# EAGLE design MotherboardV2.1 (EAGLE 7.2.0)

## Sheet 1 of 8: LATHCING CIRCUIT
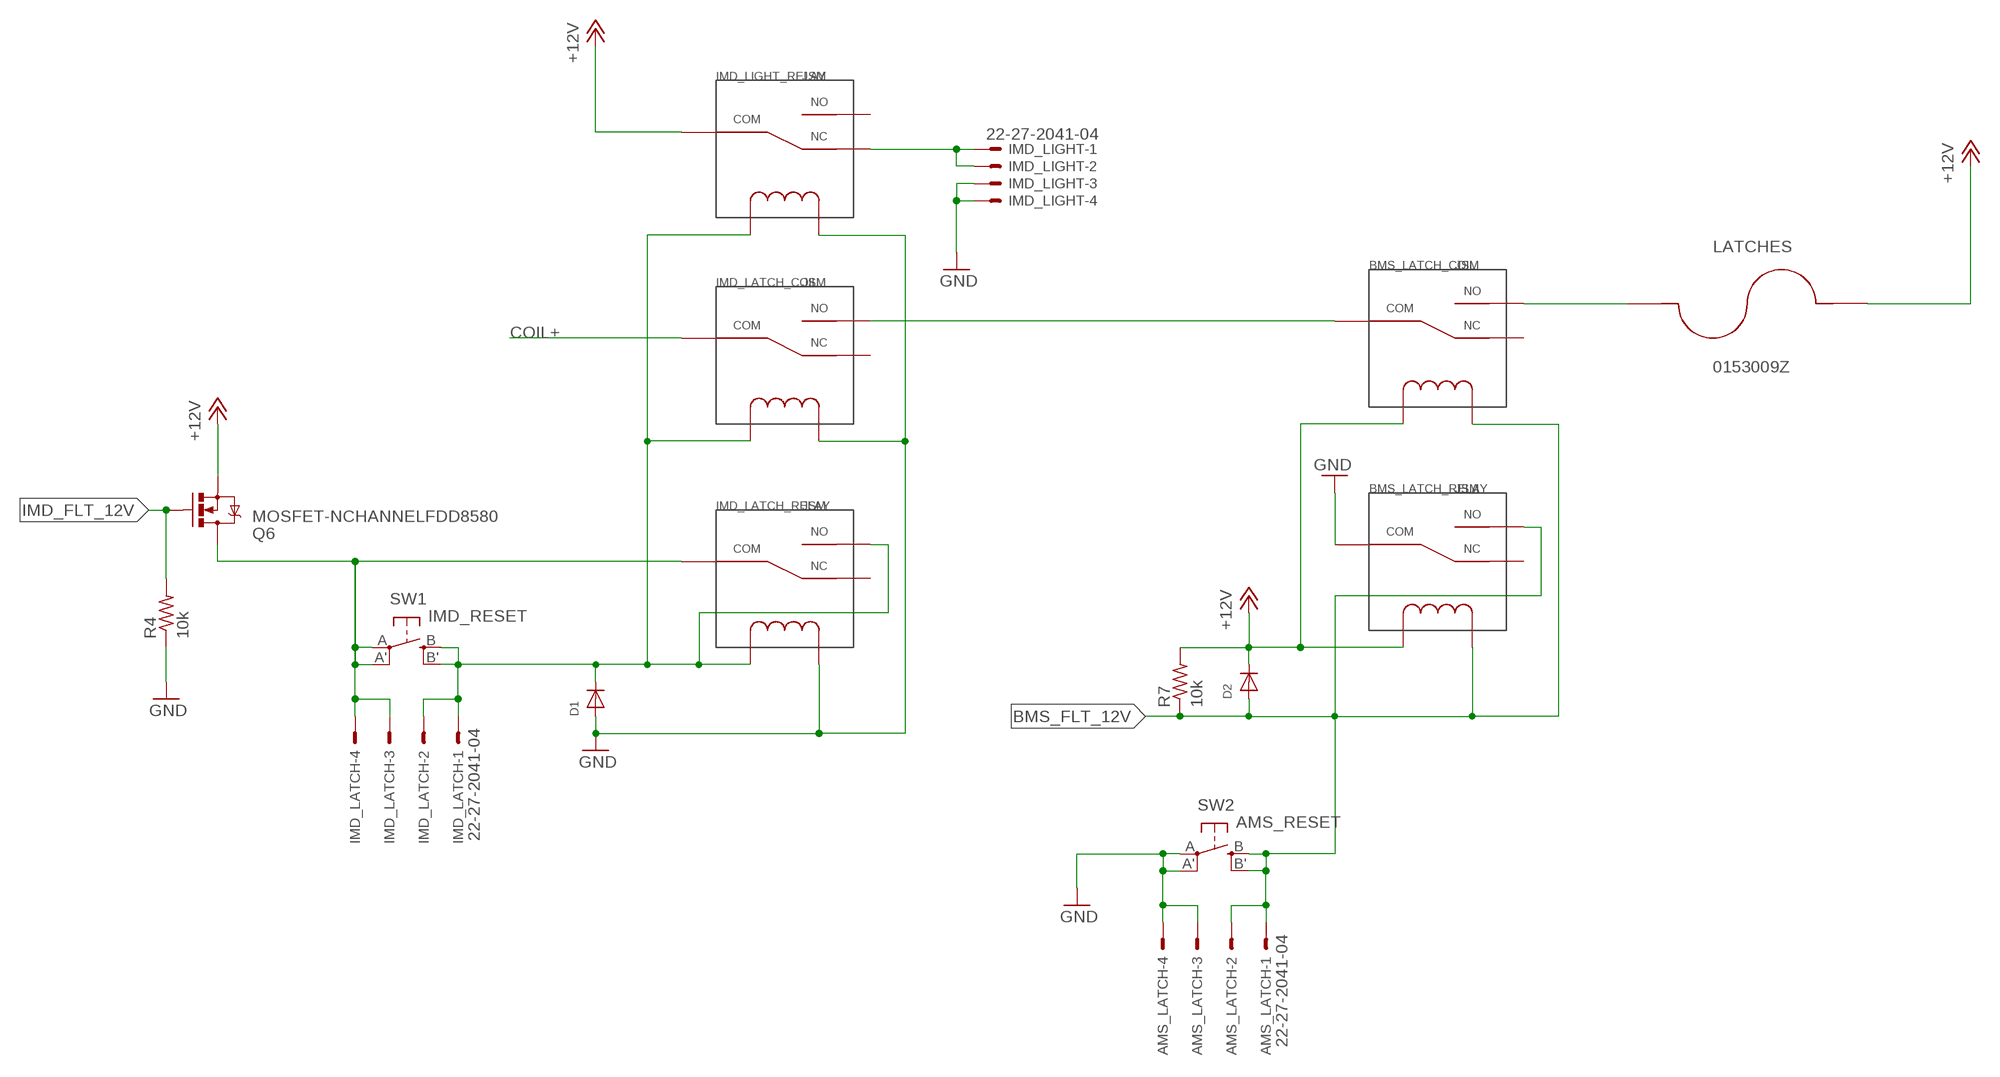
[diagram p0: schematic, sheet 1]

### Parts
AMS_LATCH  22-27-2041-04  [6410-04]
BMS_LATCH_COIL  JSM  [JS-M]
BMS_LATCH_RELAY  JSM  [JS-M]
D1  DIODESOD-123  [SOD-123]
D2  DIODESOD-123  [SOD-123]
IMD_LATCH  22-27-2041-04  [6410-04]
IMD_LATCH_COIL  JSM  [JS-M]
IMD_LATCH_RELAY  JSM  [JS-M]
IMD_LIGHT  22-27-2041-04  [6410-04]
IMD_LIGHT_RELAY  JSM  [JS-M]
LATCHES  0153009Z  [MINIFUSEHOLDER]
Q6  MOSFET-NCHANNELFDD8580  [DPAK]
R4  10k  R-US_M0805  [M0805]
R7  10k  R-US_M0805  [M0805]
SW1  IMD_RESET  SPST_TACT-EVQQ2  [EVQ-Q2]
SW2  AMS_RESET  SPST_TACT-EVQQ2  [EVQ-Q2]

### Nets
+12V: BMS_LATCH_COIL.COIL1 BMS_LATCH_RELAY.COIL1 D2.C IMD_LIGHT_RELAY.COM LATCHES.P$2 Q6.3(S) R7.2 ; also sheet 2,3,4,5,6
BMS_FLT_12V: AMS_LATCH.1 AMS_LATCH.2 BMS_LATCH_COIL.COIL2 BMS_LATCH_RELAY.COIL2 BMS_LATCH_RELAY.NO D2.A R7.1 SW2.B'(S1) SW2.B(S) ; also sheet 2,4,7
COIL+: IMD_LATCH_COIL.COM ; also sheet 2
GND: AMS_LATCH.3 AMS_LATCH.4 BMS_LATCH_RELAY.COM D1.A IMD_LATCH_COIL.COIL2 IMD_LATCH_RELAY.COIL2 IMD_LIGHT.3 IMD_LIGHT.4 IMD_LIGHT_RELAY.COIL2 R4.1 SW2.A'(P1) SW2.A(P) ; also sheet 2,3,4,5,6,7
IMD_FLT_12V: Q6.1(G) R4.2 ; also sheet 2,7
IMD_LATCH_SW1: IMD_LATCH.3 IMD_LATCH.4 IMD_LATCH_RELAY.COM Q6.4(D) SW1.A'(P1) SW1.A(P) ; also sheet 2
IMD_LATCH_SW2: D1.C IMD_LATCH.1 IMD_LATCH.2 IMD_LATCH_COIL.COIL1 IMD_LATCH_RELAY.COIL1 IMD_LATCH_RELAY.NO IMD_LIGHT_RELAY.COIL1 SW1.B'(S1) SW1.B(S) ; also sheet 2
N$11: BMS_LATCH_COIL.COM IMD_LATCH_COIL.NO
N$13: IMD_LIGHT.1 IMD_LIGHT.2 IMD_LIGHT_RELAY.NC
N$35: BMS_LATCH_COIL.NO LATCHES.P$1
Unconnected: BMS_LATCH_COIL.NC BMS_LATCH_RELAY.NC IMD_LATCH_COIL.NC IMD_LATCH_RELAY.NC IMD_LIGHT_RELAY.NO

## Sheet 2 of 8: CONNECTORS
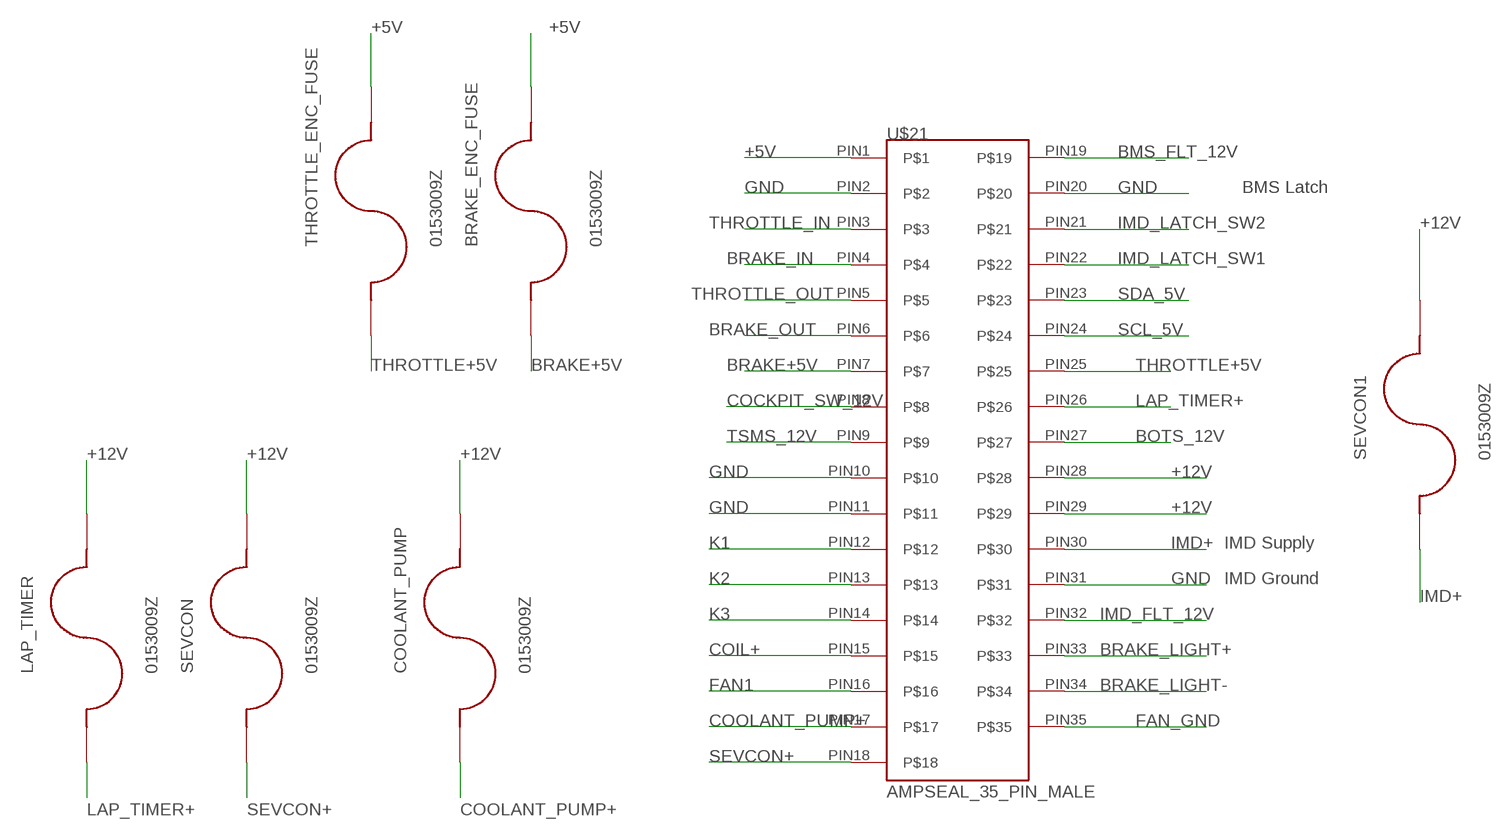
[diagram p1: schematic, sheet 2]

### Parts
BRAKE_ENC_FUSE  0153009Z  [MINIFUSEHOLDER]
COOLANT_PUMP  0153009Z  [MINIFUSEHOLDER]
LAP_TIMER  0153009Z  [MINIFUSEHOLDER]
SEVCON  0153009Z  [MINIFUSEHOLDER]
SEVCON1  0153009Z  [MINIFUSEHOLDER]
THROTTLE_ENC_FUSE  0153009Z  [MINIFUSEHOLDER]
U$21  AMPSEAL_35_PIN_MALE  [AMPSEAL_35_PIN_MALE]

### Nets
+5V: BRAKE_ENC_FUSE.P$2 THROTTLE_ENC_FUSE.P$2 U$21.PIN1 ; also sheet 5,6,7
+12V: COOLANT_PUMP.P$2 LAP_TIMER.P$2 SEVCON1.P$2 SEVCON.P$2 U$21.PIN28 U$21.PIN29 ; also sheet 1,3,4,5,6
BMS_FLT_12V: U$21.PIN19 ; also sheet 1,4,7
BOTS_12V: U$21.PIN27 ; also sheet 7
BRAKE+5V: BRAKE_ENC_FUSE.P$1 U$21.PIN7
BRAKE_IN: U$21.PIN4
BRAKE_LIGHT+: U$21.PIN33 ; also sheet 3
BRAKE_LIGHT-: U$21.PIN34 ; also sheet 3
BRAKE_OUT: U$21.PIN6
COCKPIT_SW_12V: U$21.PIN8 ; also sheet 7
COIL+: U$21.PIN15 ; also sheet 1
COOLANT_PUMP+: COOLANT_PUMP.P$1 U$21.PIN17
FAN1: U$21.PIN16 ; also sheet 4
FAN_GND: U$21.PIN35 ; also sheet 4
GND: U$21.PIN2 U$21.PIN10 U$21.PIN11 U$21.PIN20 U$21.PIN31 ; also sheet 1,3,4,5,6,7
IMD+: SEVCON1.P$1 U$21.PIN30
IMD_FLT_12V: U$21.PIN32 ; also sheet 1,7
IMD_LATCH_SW1: U$21.PIN22 ; also sheet 1
IMD_LATCH_SW2: U$21.PIN21 ; also sheet 1
K1: U$21.PIN12 ; also sheet 4
K2: U$21.PIN13 ; also sheet 4
K3: U$21.PIN14 ; also sheet 4
LAP_TIMER+: LAP_TIMER.P$1 U$21.PIN26
SCL_5V: U$21.PIN24 ; also sheet 5
SDA_5V: U$21.PIN23 ; also sheet 5
SEVCON+: SEVCON.P$1 U$21.PIN18
THROTTLE+5V: THROTTLE_ENC_FUSE.P$1 U$21.PIN25
THROTTLE_IN: U$21.PIN3
THROTTLE_OUT: U$21.PIN5
TSMS_12V: U$21.PIN9 ; also sheet 7

### Notes on the sheet
- BMS Latch
- IMD Supply
- IMD Ground

## Sheet 3 of 8: OUTPUT RELAYS
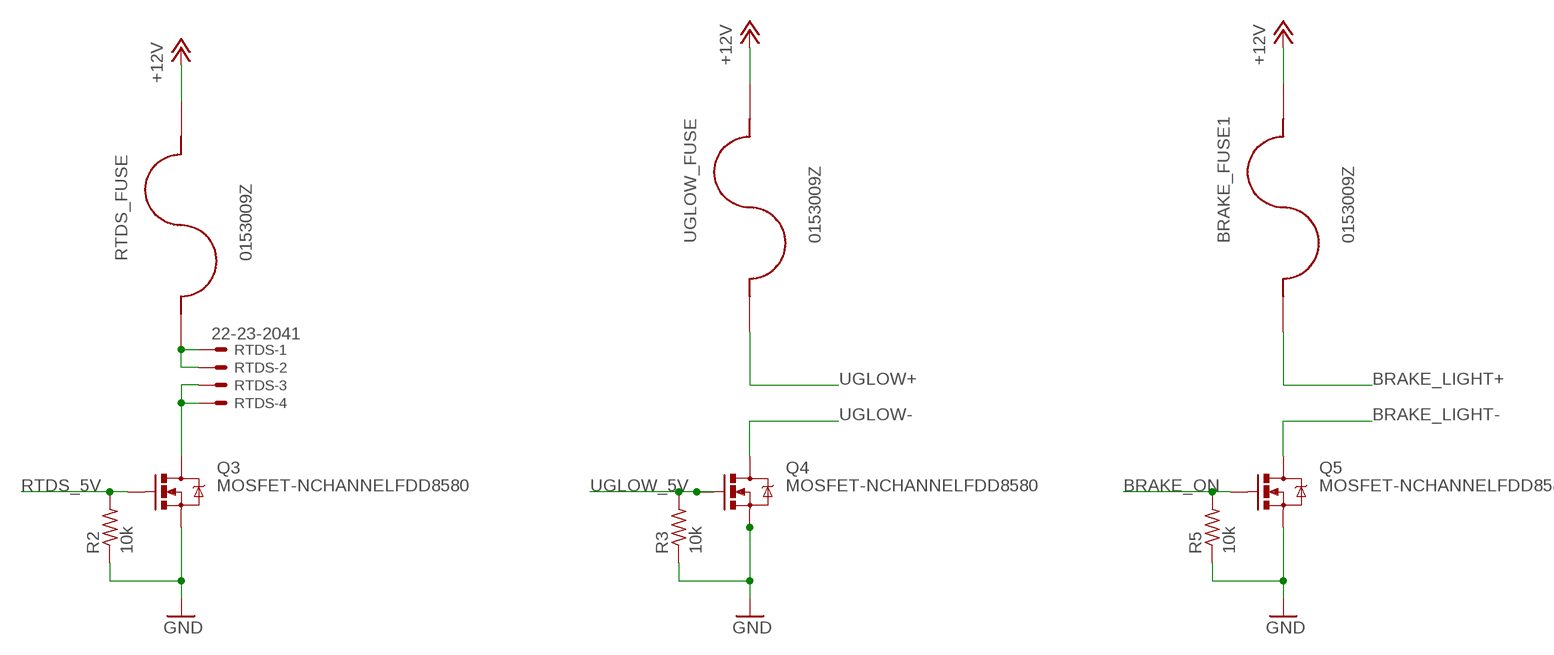
[diagram p2: schematic, sheet 3]

### Parts
BRAKE_FUSE1  0153009Z  [MINIFUSEHOLDER]
Q3  MOSFET-NCHANNELFDD8580  [DPAK]
Q4  MOSFET-NCHANNELFDD8580  [DPAK]
Q5  MOSFET-NCHANNELFDD8580  [DPAK]
R2  10k  R-US_M0805  [M0805]
R3  10k  R-US_M0805  [M0805]
R5  10k  R-US_M0805  [M0805]
RTDS  22-23-2041  [22-23-2041]
RTDS_FUSE  0153009Z  [MINIFUSEHOLDER]
UGLOW_FUSE  0153009Z  [MINIFUSEHOLDER]

### Nets
+12V: BRAKE_FUSE1.P$2 RTDS_FUSE.P$2 UGLOW_FUSE.P$2 ; also sheet 1,2,4,5,6
BRAKE_LIGHT+: BRAKE_FUSE1.P$1 ; also sheet 2
BRAKE_LIGHT-: Q5.4(D) ; also sheet 2
BRAKE_ON: Q5.1(G) R5.2
GND: Q3.3(S) Q4.3(S) Q5.3(S) R2.1 R3.1 R5.1 ; also sheet 1,2,4,5,6,7
N$1: Q3.4(D) RTDS.3 RTDS.4
N$2: RTDS.1 RTDS.2 RTDS_FUSE.P$1
RTDS_5V: Q3.1(G) R2.2 ; also sheet 5
UGLOW+: UGLOW_FUSE.P$1
UGLOW-: Q4.4(D)
UGLOW_5V: Q4.1(G) R3.2 ; also sheet 5

## Sheet 4 of 8: BMS CONNECTORS
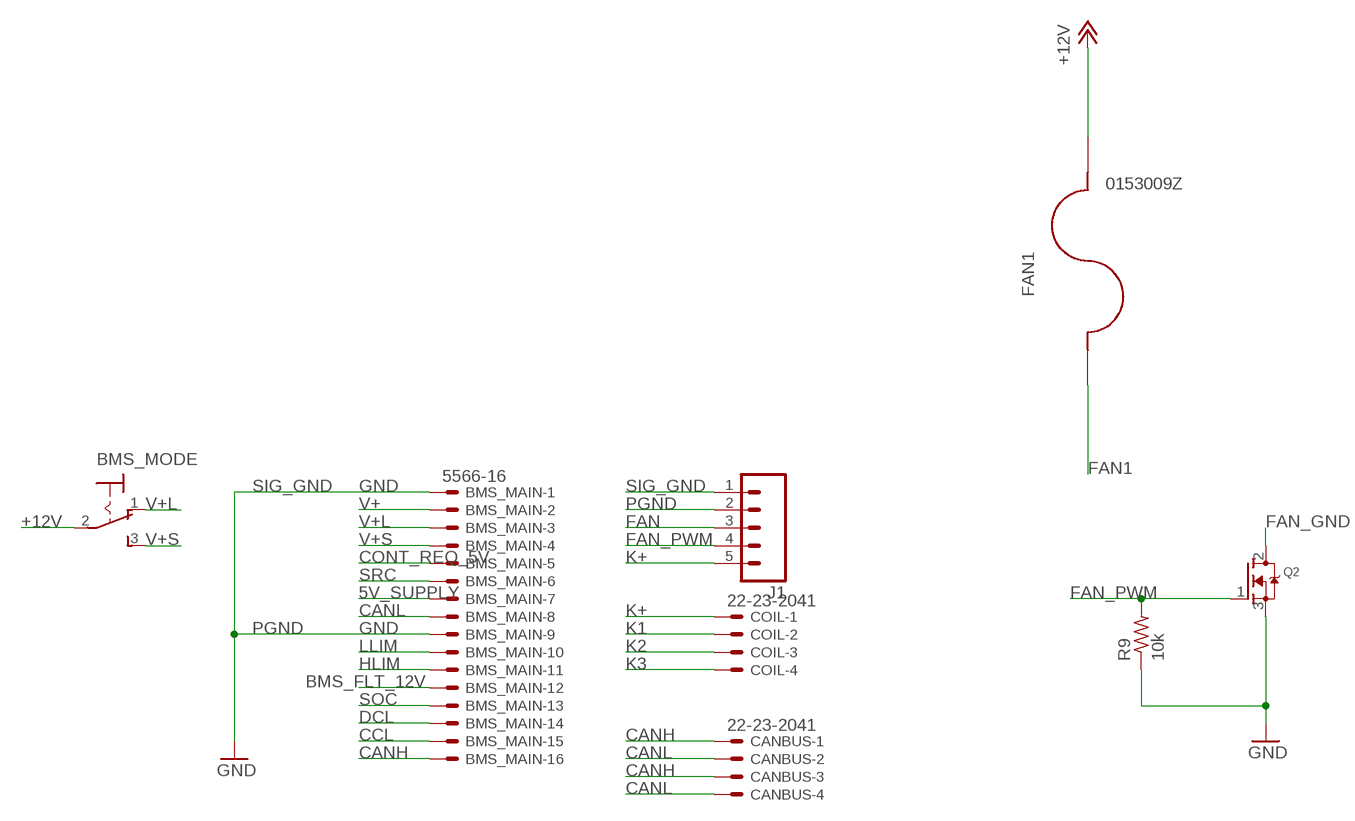
[diagram p3: schematic, sheet 4]

### Parts
BMS_MAIN  5566-16  [5566-16]
BMS_MODE  320-916  [320-916]
CANBUS  22-23-2041  [22-23-2041]
COIL  22-23-2041  [22-23-2041]
FAN1  0153009Z  [MINIFUSEHOLDER]
J1  M05LOCK  [1X05_LOCK]
Q2  MOSFET-NGDS_TO220V  [TO220V]
R9  10k  R-US_0207/9  [0207/9]

### Nets
5V_SUPPLY: BMS_MAIN.7
+12V: BMS_MODE.2(P) FAN1.P$2 ; also sheet 1,2,3,5,6
BMS_FLT_12V: BMS_MAIN.12 ; also sheet 1,2,7
CANH: BMS_MAIN.16 CANBUS.1 CANBUS.3
CANL: BMS_MAIN.8 CANBUS.2 CANBUS.4
CCL: BMS_MAIN.15
CONT_REQ_5V: BMS_MAIN.5 ; also sheet 5
DCL: BMS_MAIN.14
FAN: J1.3
FAN1: FAN1.P$1 ; also sheet 2
FAN_GND: Q2.2(D) ; also sheet 2
FAN_PWM: J1.4 Q2.1(G) R9.2
GND: BMS_MAIN.1 BMS_MAIN.9 Q2.3(S) R9.1 ; also sheet 1,2,3,5,6,7
HLIM: BMS_MAIN.11
K1: COIL.2 ; also sheet 2
K2: COIL.3 ; also sheet 2
K3: COIL.4 ; also sheet 2
K+: COIL.1 J1.5
LLIM: BMS_MAIN.10
PGND: J1.2
SIG_GND: J1.1
SOC: BMS_MAIN.13 ; also sheet 5
SRC: BMS_MAIN.6
V+: BMS_MAIN.2
V+L: BMS_MAIN.3 BMS_MODE.1(O)
V+S: BMS_MAIN.4 BMS_MODE.3(S)

### Notes on the sheet
- SIG_GND
- PGND

## Sheet 5 of 8: VCU
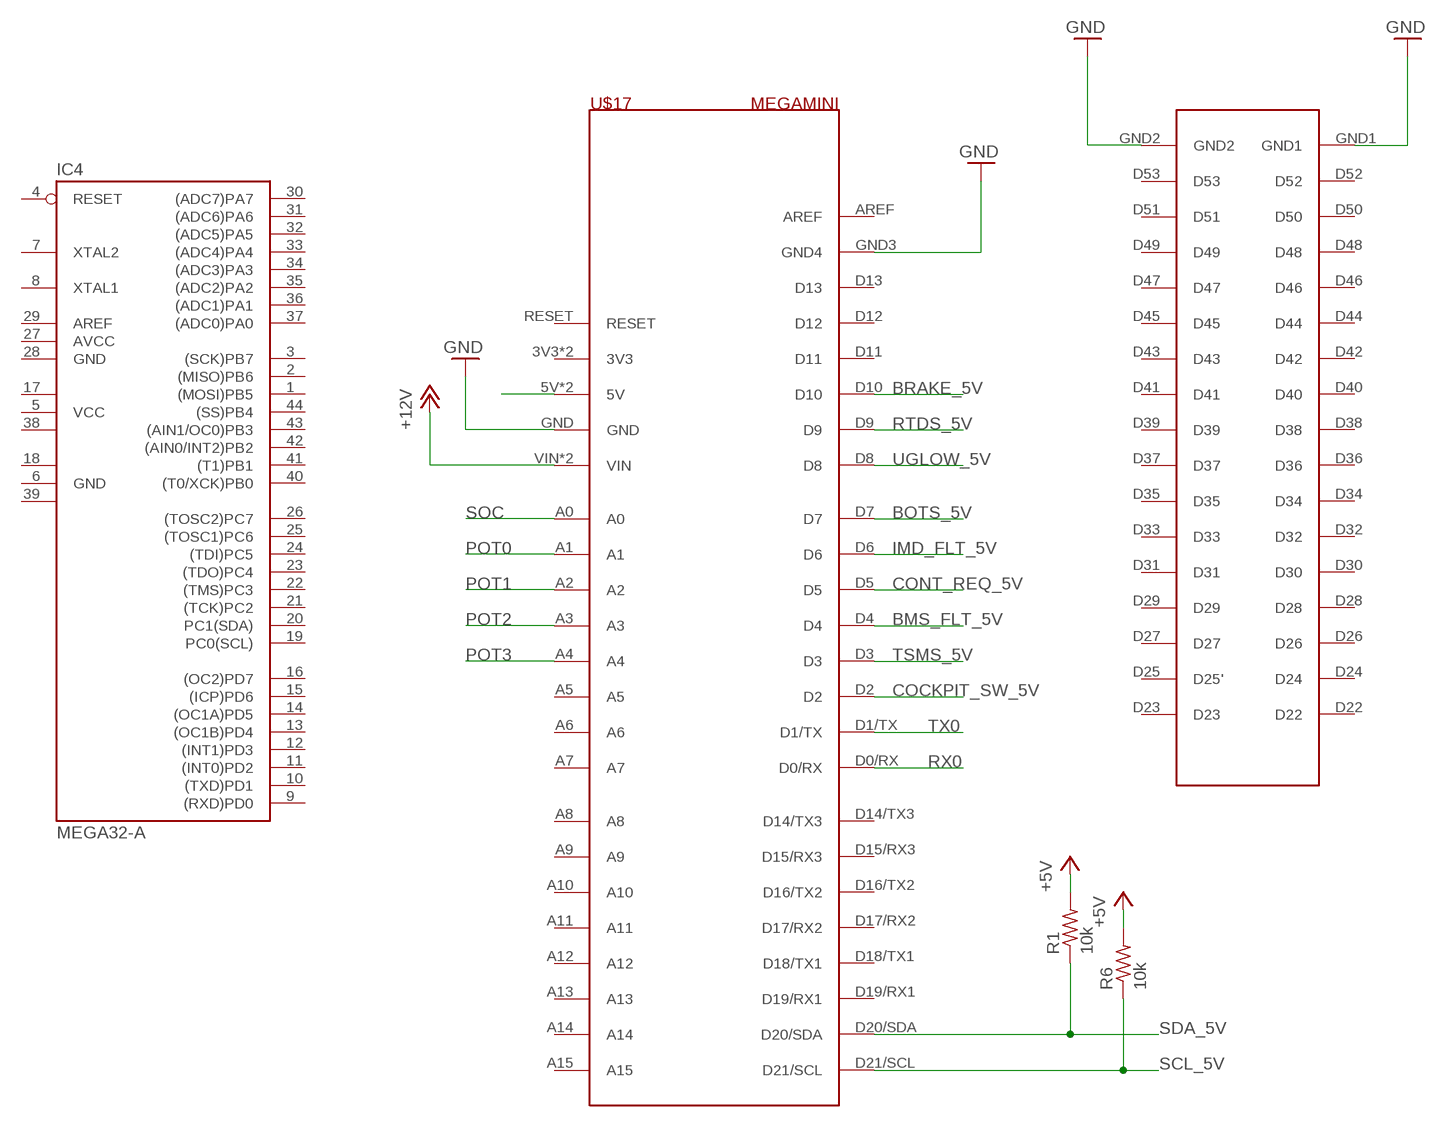
[diagram p4: schematic, sheet 5]

### Parts
IC4  MEGA32-A  [TQFP44]
R1  10k  R-US_M0805  [M0805]
R6  10k  R-US_M0805  [M0805]
U$17  MEGAMINI  [MEGAMINI]

### Nets
+5V: R1.2 R6.2 U$17.5V U$17.5V_2(5V) ; also sheet 2,6,7
+12V: U$17.VIN U$17.VIN_2(VIN) ; also sheet 1,2,3,4,6
BMS_FLT_5V: U$17.D4 ; also sheet 7
BOTS_5V: U$17.D7 ; also sheet 7
BRAKE_5V: U$17.D10
COCKPIT_SW_5V: U$17.D2 ; also sheet 7
CONT_REQ_5V: U$17.D5 ; also sheet 4
GND: U$17.GND U$17.GND1 U$17.GND2 U$17.GND3(GND4) ; also sheet 1,2,3,4,6,7
IMD_FLT_5V: U$17.D6 ; also sheet 7
POT0: U$17.A1
POT1: U$17.A2
POT2: U$17.A3
POT3: U$17.A4
RTDS_5V: U$17.D9 ; also sheet 3
RX0: U$17.D0/RX
SCL_5V: R6.1 U$17.D21/SCL ; also sheet 2
SDA_5V: R1.1 U$17.D20/SDA ; also sheet 2
SOC: U$17.A0 ; also sheet 4
TSMS_5V: U$17.D3 ; also sheet 7
TX0: U$17.D1/TX
UGLOW_5V: U$17.D8 ; also sheet 3
Unconnected: IC4.1((MOSI)PB5) IC4.2((MISO)PB6) IC4.3((SCK)PB7) IC4.4(RESET) IC4.7(XTAL2) IC4.8(XTAL1) IC4.9((RXD)PD0) IC4.10((TXD)PD1) IC4.11((INT0)PD2) IC4.12((INT1)PD3) IC4.13((OC1B)PD4) IC4.14((OC1A)PD5) IC4.15((ICP)PD6) IC4.16((OC2)PD7) IC4.19(PC0(SCL)) IC4.20(PC1(SDA)) IC4.21((TCK)PC2) IC4.22((TMS)PC3) IC4.23((TDO)PC4) IC4.24((TDI)PC5) IC4.25((TOSC1)PC6) IC4.26((TOSC2)PC7) IC4.29(AREF) IC4.30((ADC7)PA7) IC4.31((ADC6)PA6) IC4.32((ADC5)PA5) IC4.33((ADC4)PA4) IC4.34((ADC3)PA3) IC4.35((ADC2)PA2) IC4.36((ADC1)PA1) IC4.37((ADC0)PA0) IC4.40((T0/XCK)PB0) IC4.41((T1)PB1) IC4.42((AIN0/INT2)PB2) IC4.43((AIN1/OC0)PB3) IC4.44((SS)PB4) U$17.3V3 U$17.3V3_2(3V3) U$17.A5 U$17.A6 U$17.A7 U$17.A8 U$17.A9 U$17.A10 U$17.A11 U$17.A12 U$17.A13 U$17.A14 U$17.A15 U$17.AREF U$17.D11 U$17.D12 U$17.D13 U$17.D14/TX3 U$17.D15/RX3 U$17.D16/TX2 U$17.D17/RX2 U$17.D18/TX1 U$17.D19/RX1 U$17.D22 U$17.D23 U$17.D24 U$17.D25(D25') U$17.D26 U$17.D27 U$17.D28 U$17.D29 U$17.D30 U$17.D31 U$17.D32 U$17.D33 U$17.D34 U$17.D35 U$17.D36 U$17.D37 U$17.D38 U$17.D39 U$17.D40 U$17.D41 U$17.D42 U$17.D43 U$17.D44 U$17.D45 U$17.D46 U$17.D47 U$17.D48 U$17.D49 U$17.D50 U$17.D51 U$17.D52 U$17.D53 U$17.RESET

## Sheet 6 of 8: REGULATORS
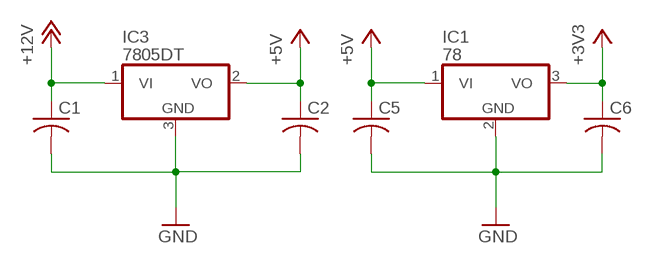
[diagram p5: schematic, sheet 6]

### Parts
C1  C-USC0805K  [C0805K]
C2  C-USC0805K  [C0805K]
C5  C-USC0805K  [C0805K]
C6  C-USC0805K  [C0805K]
IC1  78  [D2PAK]
IC3  7805DT  [TO252]

### Nets
+3V3: C6.1 IC1.3(VO)
+5V: C2.1 C5.1 IC1.1(VI) IC3.2(VO) ; also sheet 2,5,7
+12V: C1.1 IC3.1(VI) ; also sheet 1,2,3,4,5
GND: C1.2 C2.2 C5.2 C6.2 IC1.2(GND) IC3.3(GND) ; also sheet 1,2,3,4,5,7

## Sheet 7 of 8: LEVEL SHIFTING
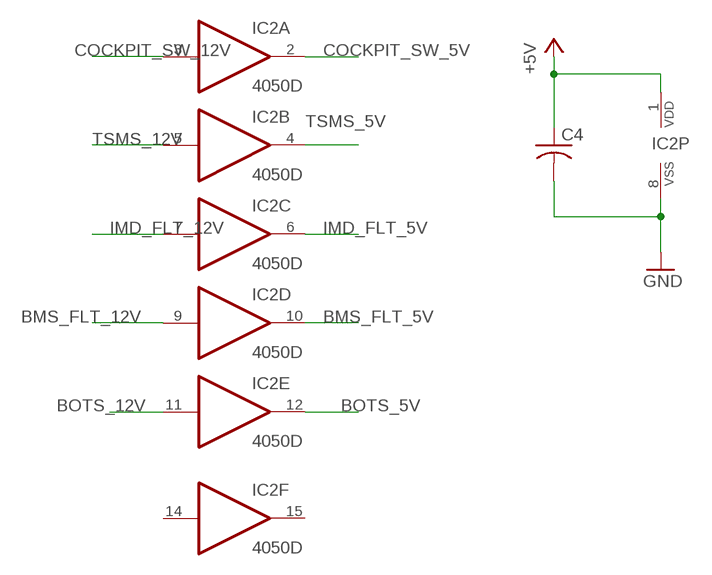
[diagram p6: schematic, sheet 7]

### Parts
C4  C-US050-024X044  [C050-024X044]
IC2  4050D  [SO16]

### Nets
+5V: C4.1 IC2.1(P:VDD) ; also sheet 2,5,6
BMS_FLT_5V: IC2.10(D:O) ; also sheet 5
BMS_FLT_12V: IC2.9(D:I) ; also sheet 1,2,4
BOTS_5V: IC2.12(E:O) ; also sheet 5
BOTS_12V: IC2.11(E:I) ; also sheet 2
COCKPIT_SW_5V: IC2.2(A:O) ; also sheet 5
COCKPIT_SW_12V: IC2.3(A:I) ; also sheet 2
GND: C4.2 IC2.8(P:VSS) ; also sheet 1,2,3,4,5,6
IMD_FLT_5V: IC2.6(C:O) ; also sheet 5
IMD_FLT_12V: IC2.7(C:I) ; also sheet 1,2
TSMS_5V: IC2.4(B:O) ; also sheet 5
TSMS_12V: IC2.5(B:I) ; also sheet 2
Unconnected: IC2.14(F:I) IC2.15(F:O)

## Sheet 8 of 8

## Power pins joined to a net without a drawn wire
AVCC: IC4.27(AVCC)
GND: IC4.6(GND) IC4.28(GND)
GND1: IC4.18(GND1)
GND2: IC4.39(GND2)
VCC: IC4.5(VCC)
VCC1: IC4.17(VCC1)
VCC2: IC4.38(VCC2)

## Library data of the parts
AMS_LATCH IMD_LATCH IMD_LIGHT = con-molex:22-?-04: CONNECTOR wire to board 2.54 mm (.1 inch) pitch header; OC_FARNELL: unknown; OC_NEWARK: unknown
BMS_LATCH_COIL BMS_LATCH_RELAY IMD_LATCH_COIL IMD_LATCH_RELAY IMD_LIGHT_RELAY = panasonic:JSM
BMS_MAIN = con-molex:5566-16: Mini FIT connector 16 pol Source: http://www.molex.com; OC_FARNELL: unknown; OC_NEWARK: unknown
BMS_MODE = switch:320-916: TOGGLE SWITCH distributor RS Components
BRAKE_ENC_FUSE BRAKE_FUSE1 COOLANT_PUMP FAN1 LAP_TIMER LATCHES RTDS_FUSE SEVCON SEVCON1 THROTTLE_ENC_FUSE UGLOW_FUSE = littelfuse:0153009Z: http://www.digikey.com/product-search/en/circuit-protection/fuseholders/655422?k=01530009 MINI ATC, MINI ATO Blade fuse holder
C1 C2 C4-C6 = adafruit:C-US: CAPACITOR, American symbol
CANBUS COIL RTDS = con-molex:22-23-2041: .100" (2.54mm) Center Header - 4 Pin; MF: MOLEX; MPN: 22-23-2041; OC_FARNELL: 1462920; OC_NEWARK: 38C0355
D1 D2 = adafruit:DIODE: Diode SMADIODE - SMA Surface Mount Package 20V 1A Schottky Diode Digikey: 641-1014-6-ND DO-1N4148 - Through Hole Small Current Diode SOD-123 20V 1 A (.5mV Vf) Schottky Diode - Digikey: MBRX120TPMSCT-ND SOD-323 10V 570mA (.38mV Vf, 3ns) Schottky Diode - Digikey: ZLLS410CT-ND SOD-523 30V 30mA Schottky Diode (RB751S-40TE61) - Digikey: RB751S-40TE61CT-ND SOT23-R/W - SOT23 Package (R = Solder Paste/Reflow Ovens, W = Hand-Soldering) BAT54Film 40V 300mA - Digikey: 497-7162-1-ND
IC1 IC3 = linear:78*: Positive VOLTAGE REGULATOR Source: http://cache.national.com/ds/LM/LM78L05.pdf http://www.fairchildsemi.com/ds/LM/LM7805.pdf
IC2 = 40xx:4050: Hex non-inverting BUFFER
IC4 = atmel:MEGA32: MICROCONTROLLER 32 Kbytes FLASH 2 Kbytes SRAM 1 Kbytes EEPROM USART 8-channel 10 bit ADC Source: www.atmel.com .. doc2503.pdf; MPN: ATMEGA32-16AU; OC_FARNELL: 9171274; OC_NEWARK: 69K6677
J1 = SparkFun-Connectors:M05: Header 5 Standard 5-pin 0.1" header. Use with straight break away headers (SKU : PRT-00116), right angle break away headers (PRT-00553), swiss pins (PRT-00743), machine pins (PRT-00117), and female headers (PRT-00115). Molex polarized connector foot print use with SKU : PRT-08230 with associated crimp pins and housings.
Q2 = adafruit:MOSFET-N: N-Channel Mosfet 2N7002E - 60V 260mA SOT23 [Digikey: 2N7002ET1GOSTR-ND] - REEL BSH103 - 30V 850mA SOT23 [Digikey: 568-5013-1-ND]
Q3-Q6 = fets:MOSFET-NCHANNEL: Generic NMOS footprint
R1-R7 R9 = adafruit:R-US_: RESISTOR, American symbol
SW1 SW2 = adafruit:SPST_TACT: SMT 6mm switch, EVQQ2 series http://www.ladyada.net/library/eagle
U$17 = Mega-mini:MEGAMINI
U$21 = AMPSEAL 35 PIN MALE:AMPSEAL_35_PIN_MALE

## Board
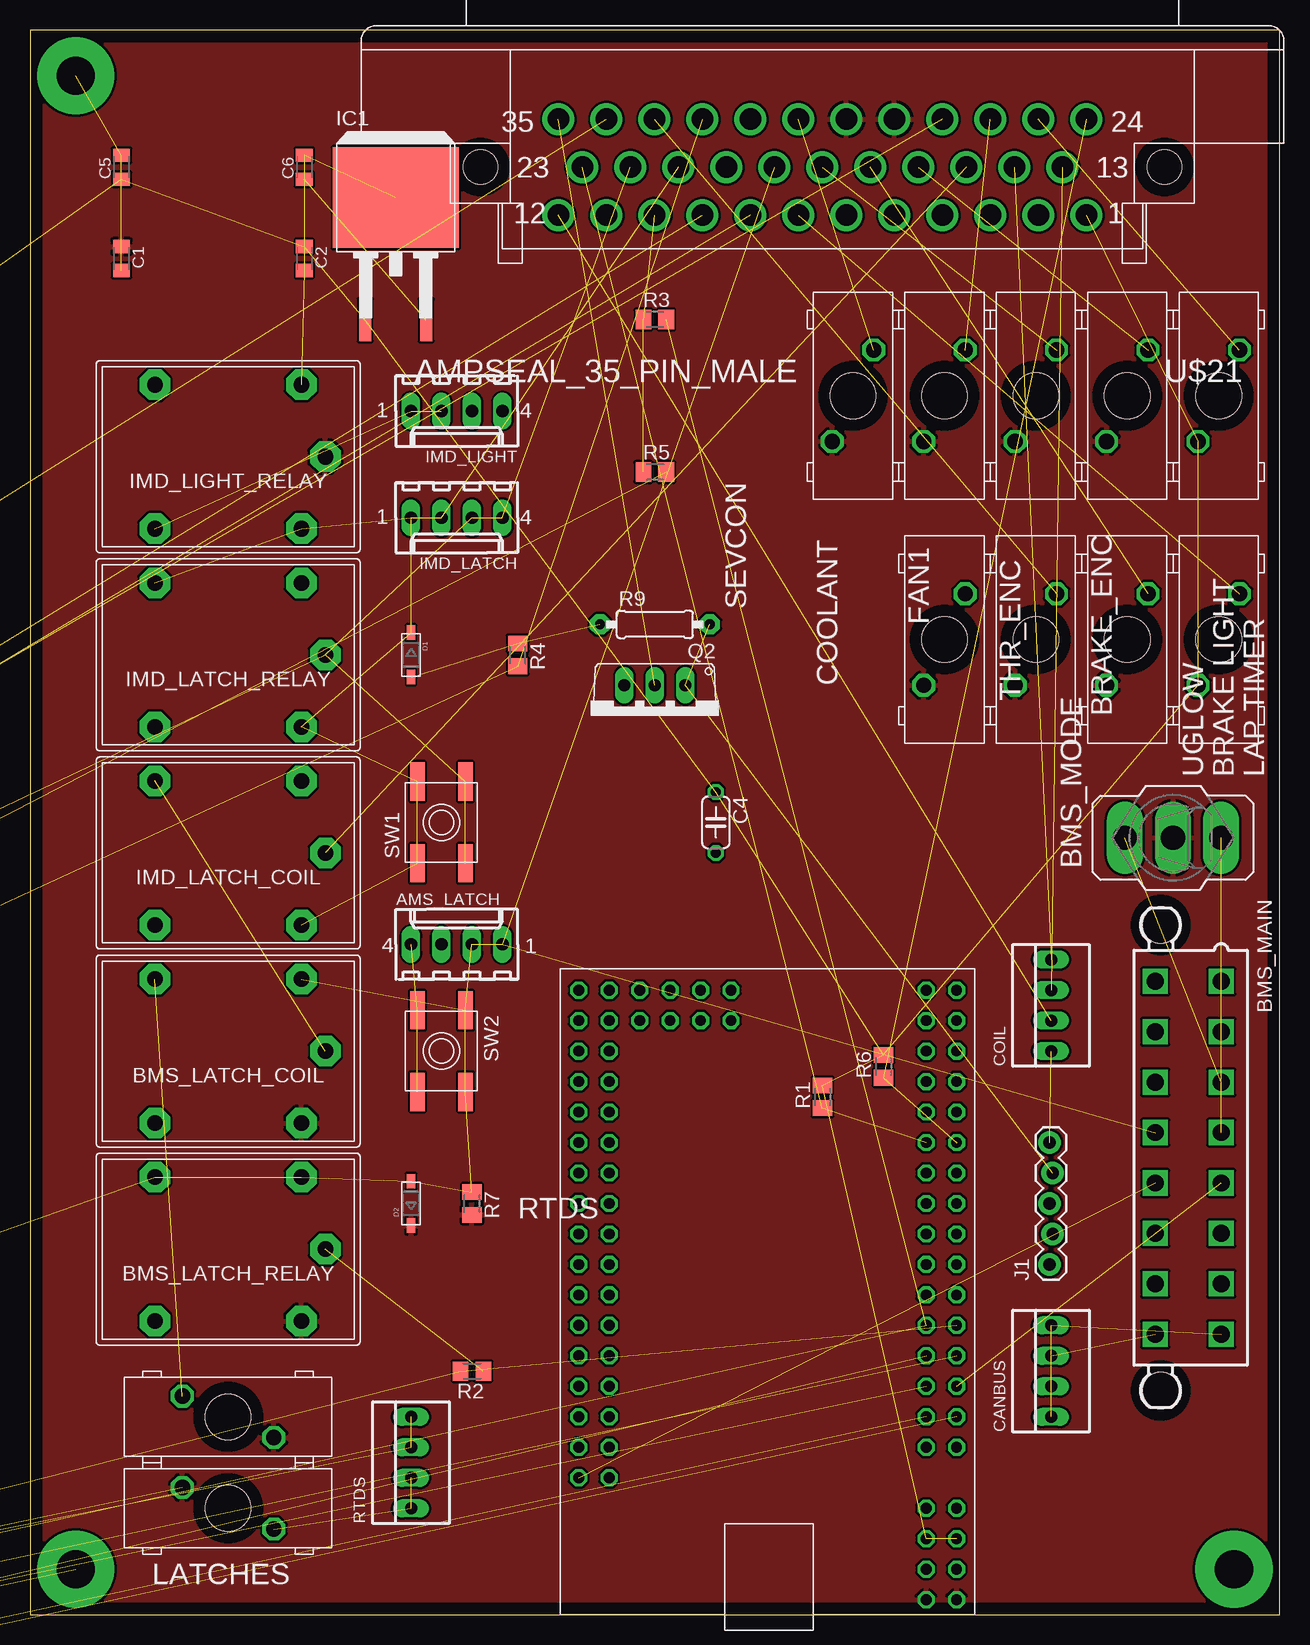
[diagram p7: board, top side]
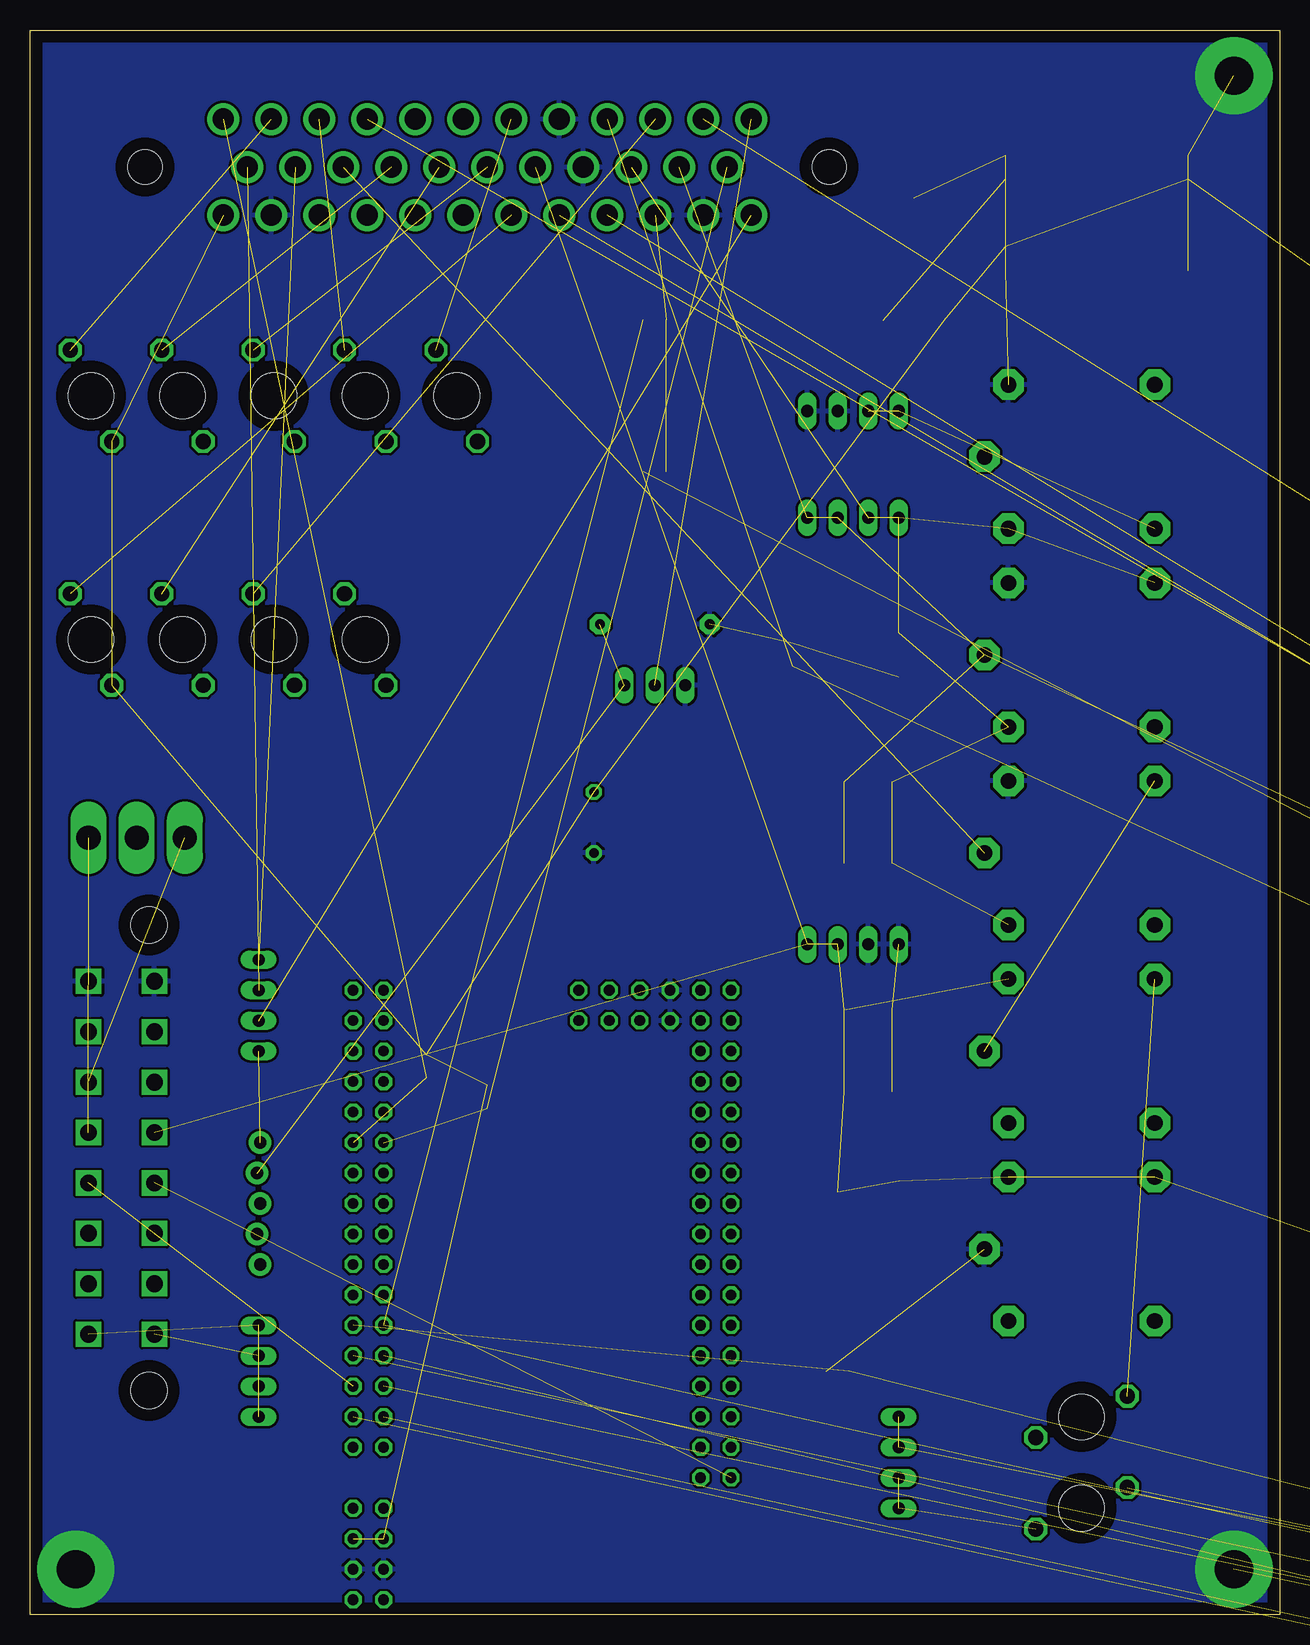
[diagram p8: board, bottom side, seen from below]

Size 104.14 x 132.08 mm. Coordinates in mm from the lower left corner, seen from the top.
Outline: 0,0 104.14,0 104.14,132.08 0,132.08 0,0
Copper layers (1*16): Top 0.035mm / dielectric 1.5mm / Bottom 0.035mm
Design rules "default": minimum track width 10mil, minimum drill 24mil, track to track 8mil, track to pad 8mil, pad to pad 8mil, via to via 8mil, smd to smd 8mil, copper to edge 40mil, drill to drill 8mil, minimum pad ring 10mil, minimum via ring 8mil, stop-mask expansion 4mil, vias tented up to drill 0mil, thermal gap 10mil

### Footprints (pad centres in the part's own frame; a part is rotated, then mirrored left to right if it is on the bottom)
6410-04 = drill 1.016 long: 1 3.81,0; 2 1.27,0; 3 -1.27,0; 4 -3.81,0
JS-M = drill 1.3 pad 2.54 octagon: COIL1 -6.1,6; COIL2 -6.1,-6; COM -8.1,0; NC 6.1,6; NO 6.1,-6
5566-16 = drill 1.4 square: 1 14.7,-2.75; 2 10.5,-2.75; 3 6.3,-2.75; 4 2.1,-2.75; 5 -2.1,-2.75; 6 -6.3,-2.75; 7 -10.5,-2.75; 8 -14.7,-2.75; 9 14.7,2.75; 10 10.5,2.75; 11 6.3,2.75; 12 2.1,2.75; 13 -2.1,2.75; 14 -6.3,2.75; 15 -10.5,2.75; 16 -14.7,2.75 | hole 3: 19.4,2.29; -19.4,2.29
320-916 = drill 2.007 long: 1 0,4.013; 2 0,0; 3 0,-4.013
MINIFUSEHOLDER = drill 1.27 octagon: P$1 1.727,3.81; P$2 -1.727,-3.81 | hole 3.785: 0,0
C0805K = smd 1.1 x 1.4: 1 -1,0; 2 1,0
C050-024X044 = drill 0.813 octagon: 1 -2.54,0; 2 2.54,0
22-23-2041 = drill 1 long: 1 -3.81,0; 2 -1.27,0; 3 1.27,0; 4 3.81,0
SOD-123 = smd 1.2 x 0.7: A 1.85,0; C -1.85,0
D2PAK = smd 1.016 x 3.504: 1 -2.54,-10.213; 3 2.54,-10.213 | smd 10.49 x 8.38: 2 0,0
SO16 = smd 0.66 x 2.032: 1 -4.445,-3.073; 2 -3.175,-3.073; 3 -1.905,-3.073; 4 -0.635,-3.073; 5 0.635,-3.073; 6 1.905,-3.073; 7 3.175,-3.073; 8 4.445,-3.073; 9 4.445,3.073; 10 3.175,3.073; 11 1.905,3.073; 12 0.635,3.073; 13 -0.635,3.073; 14 -1.905,3.073; 15 -3.175,3.073; 16 -4.445,3.073
TO252 = smd 1 x 1.6: 1 -2.28,-4.8; 2 2.28,-4.8 | smd 5.4 x 6.2: 3 0,2.5
TQFP44 = smd 1.5 x 0.5: 1 -5.8,4; 2 -5.8,3.2; 3 -5.8,2.4; 4 -5.8,1.6; 5 -5.8,0.8; 6 -5.8,0; 7 -5.8,-0.8; 8 -5.8,-1.6; 9 -5.8,-2.4; 10 -5.8,-3.2; 11 -5.8,-4; 23 5.8,-4; 24 5.8,-3.2; 25 5.8,-2.4; 26 5.8,-1.6; 27 5.8,-0.8; 28 5.8,0; 29 5.8,0.8; 30 5.8,1.6; 31 5.8,2.4; 32 5.8,3.2; 33 5.8,4 | smd 0.5 x 1.5: 12 -4,-5.8; 13 -3.2,-5.8; 14 -2.4,-5.8; 15 -1.6,-5.8; 16 -0.8,-5.8; 17 0,-5.8; 18 0.8,-5.8; 19 1.6,-5.8; 20 2.4,-5.8; 21 3.2,-5.8; 22 4,-5.8; 34 4,5.8; 35 3.2,5.8; 36 2.4,5.8; 37 1.6,5.8; 38 0.8,5.8; 39 0,5.8; 40 -0.8,5.8; 41 -1.6,5.8; 42 -2.4,5.8; 43 -3.2,5.8; 44 -4,5.8
1X05_LOCK = drill 1.016 pad 1.88: 1 0,0.127; 2 2.54,-0.127; 3 5.08,0.127; 4 7.62,-0.127; 5 10.16,0.127
TO220V = drill 1.016 long: 1 -2.54,-2.54; 2 0,-2.54; 3 2.54,-2.54
DPAK = smd 1.6 x 3: 1 -2.28,-5.31; 3 2.28,-5.31 | smd 4.826 x 5.715: 4 0,1.588
M0805 = smd 1.3 x 1.6: 1 -0.95,0; 2 0.95,0
0207/9 = drill 0.813 pad 1.676 octagon: 1 -4.572,0; 2 4.572,0
EVQ-Q2 = smd 3.2 x 1.2: A -3.4,-2; A' 3.4,-2; B -3.4,2; B' 3.4,2
MEGAMINI = drill 0.9 octagon: 3V3 8.89,1.524; 3V3_2 8.89,4.064; 5V 6.35,1.524; 5V_2 6.35,4.064; A0 11.43,33.02; A1 11.43,30.48; A2 13.97,33.02; A3 13.97,30.48; A4 16.51,33.02; A5 16.51,30.48; A6 19.05,33.02; A7 19.05,30.48; A8 21.59,33.02; A9 21.59,30.48; A10 24.13,33.02; A11 24.13,30.48; A12 26.67,33.02; A13 26.67,30.48; A14 29.21,33.02; A15 29.21,30.48; AREF 31.75,33.02; D0/RX 13.97,4.064; D1/TX 13.97,1.524; D2 16.51,4.064; D3 16.51,1.524; D4 19.05,4.064; D5 19.05,1.524; D6 21.59,4.064; D7 21.59,1.524; D8 24.13,4.064; D9 24.13,1.524; D10 26.67,4.064; D11 26.67,1.524; D12 29.21,4.064; D13 29.21,1.524; D14/TX3 31.75,4.064; D15/RX3 31.75,1.524; D16/TX2 34.29,4.064; D17/RX2 34.29,1.524; D18/TX1 36.83,4.064; D19/RX1 36.83,1.524; D20/SDA 39.37,4.064; D21/SCL 39.37,1.524; D22 41.91,4.064; D23 41.91,1.524; D24 44.45,4.064; D25 44.45,1.524; D26 46.99,4.064; D27 46.99,1.524; D28 49.53,4.064; D29 49.53,1.524; D30 52.07,4.064; D31 52.07,1.524; D32 34.29,33.02; D33 34.29,30.48; D34 36.83,33.02; D35 36.83,30.48; D36 39.37,33.02; D37 39.37,30.48; D38 41.91,33.02; D39 41.91,30.48; D40 44.45,33.02; D41 44.45,30.48; D42 46.99,33.02; D43 46.99,30.48; D44 49.53,33.02; D45 49.53,30.48; D46 52.07,33.02; D47 52.07,30.48; D48 52.07,25.4; D49 49.53,25.4; D50 52.07,22.86; D51 49.53,22.86; D52 52.07,20.32; D53 49.53,20.32; GND 49.53,27.94; GND1 52.07,27.94; GND2 3.81,4.064; GND3 3.81,1.524; RESET 31.75,30.48; VIN 1.27,1.524; VIN_2 1.27,4.064
AMPSEAL_35_PIN_MALE = drill 1.778 pad 2.54: PIN1 -22,4; PIN2 -18,4; PIN3 -14,4; PIN4 -10,4; PIN5 -6,4; PIN6 -2,4; PIN7 2,4; PIN8 6,4; PIN9 10,4; PIN10 14,4; PIN11 18,4; PIN12 22,4; PIN13 -20,0; PIN14 -16,0; PIN15 -12,0; PIN16 -8,0; PIN17 -4,0; PIN18 0,0; PIN19 4,0; PIN20 8,0; PIN21 12,0; PIN22 16,0; PIN23 20,0; PIN24 -22,-4; PIN25 -18,-4; PIN26 -14,-4; PIN27 -10,-4; PIN28 -6,-4; PIN29 -2,-4; PIN30 2,-4; PIN31 6,-4; PIN32 10,-4; PIN33 14,-4; PIN34 18,-4; PIN35 22,-4 | hole 2.85: -28.5,0; 28.5,0

### Placement (x,y rotation side)
AMS_LATCH  35.56,55.88 0 top
BMS_LATCH_COIL  16.51,46.99 180 top
BMS_LATCH_RELAY  16.51,30.48 180 top
BMS_MAIN  96.52,38.1 90 top
BMS_MODE  95.25,64.77 90 top
BRAKE_ENC_FUSE  99.06,81.28 0 top
BRAKE_FUSE1  83.82,81.28 0 top
C1  7.62,113.03 270 top
C2  22.86,113.03 270 top
C4  57.15,66.04 270 top
C5  7.62,120.65 90 top
C6  22.86,120.65 90 top
CANBUS  85.09,20.32 90 top
COIL  85.09,50.8 90 top
COOLANT_PUMP  91.44,81.28 0 top
D1  31.75,80.01 270 top
D2  31.75,34.29 90 top
FAN1  91.44,101.6 0 top
IC1  30.48,118.11 0 top
IC2  -210.82,-43.18 0 top  (outside the outline)
IC3  -213.36,-30.48 0 top  (outside the outline)
IC4  -226.06,-36.83 0 top  (outside the outline)
IMD_LATCH  35.56,91.44 180 top
IMD_LATCH_COIL  16.51,63.5 180 top
IMD_LATCH_RELAY  16.51,80.01 180 top
IMD_LIGHT  35.56,100.33 180 top
IMD_LIGHT_RELAY  16.51,96.52 180 top
J1  85.09,29.21 90 top
LAP_TIMER  76.2,101.6 0 top
LATCHES  16.51,16.51 90 top
Q2  52.07,74.93 180 top
Q3  -176.53,-29.21 0 top  (outside the outline)
Q4  -185.42,-29.21 0 top  (outside the outline)
Q5  -194.31,-29.21 0 top  (outside the outline)
Q6  -203.2,-29.21 0 top  (outside the outline)
R1  66.04,43.18 90 top
R2  36.83,20.32 180 top
R3  52.07,107.95 0 top
R4  40.64,80.01 270 top
R5  52.07,95.25 0 top
R6  71.12,45.72 90 top
R7  36.83,34.29 270 top
R9  52.07,82.55 0 top
RTDS  31.75,12.7 90 top
RTDS_FUSE  16.51,8.89 270 top
SEVCON  83.82,101.6 0 top
SEVCON1  68.58,101.6 0 top
SW1  34.29,66.04 90 top
SW2  34.29,46.99 270 top
THROTTLE_ENC_FUSE  99.06,101.6 0 top
U$17  78.74,0 90 top
U$21  66.04,120.65 180 top
UGLOW_FUSE  76.2,81.28 0 top

### Tracks (layer width: path | path; a pad name or v marks a point on that pad's centre or on a via)
+3V3  (1 unrouted)
+5V  (12 unrouted)
+12V  (2 unrouted)
  pour Top: 0,135.89 0,-20.32 107.95,-20.32 107.95,135.89
BMS_FLT_5V  (1 unrouted)
BMS_FLT_12V  (11 unrouted)
BOTS_5V  (1 unrouted)
BOTS_12V  (1 unrouted)
BRAKE+5V  (1 unrouted)
BRAKE_LIGHT+  (1 unrouted)
BRAKE_LIGHT-  (1 unrouted)
BRAKE_ON  (1 unrouted)
CANH  (2 unrouted)
CANL  (2 unrouted)
COCKPIT_SW_5V  (1 unrouted)
COCKPIT_SW_12V  (1 unrouted)
COIL+  (1 unrouted)
CONT_REQ_5V  (1 unrouted)
COOLANT_PUMP+  (1 unrouted)
FAN1  (1 unrouted)
FAN_GND  (1 unrouted)
FAN_PWM  (2 unrouted)
GND  (via drill 3.2 pad 6.45)  (19 unrouted)
  other vias: 3.81,3.81 100.33,3.81 3.81,128.27
  pour Bottom: 0,132.08 104.14,132.08 104.14,-25.4 0,-25.4
IMD+  (1 unrouted)
IMD_FLT_5V  (1 unrouted)
IMD_FLT_12V  (3 unrouted)
IMD_LATCH_SW1  (6 unrouted)
IMD_LATCH_SW2  (9 unrouted)
K1  (1 unrouted)
K2  (1 unrouted)
K3  (1 unrouted)
K+  (1 unrouted)
LAP_TIMER+  (1 unrouted)
N$1  (2 unrouted)
N$2  (2 unrouted)
N$11  (1 unrouted)
N$13  (2 unrouted)
N$35  (1 unrouted)
RTDS_5V  (2 unrouted)
SCL_5V  (2 unrouted)
SDA_5V  (2 unrouted)
SEVCON+  (1 unrouted)
SOC  (1 unrouted)
THROTTLE+5V  (1 unrouted)
TSMS_5V  (1 unrouted)
TSMS_12V  (1 unrouted)
UGLOW_5V  (2 unrouted)
V+L  (1 unrouted)
V+S  (1 unrouted)

### Text on the board
tNames: SEVCON | FAN1 | COOLANT | THR_ENC | BRAKE_ENC | UGLOW | BRAKE LIGHT | LAP TIMER | RTDS | LATCHES